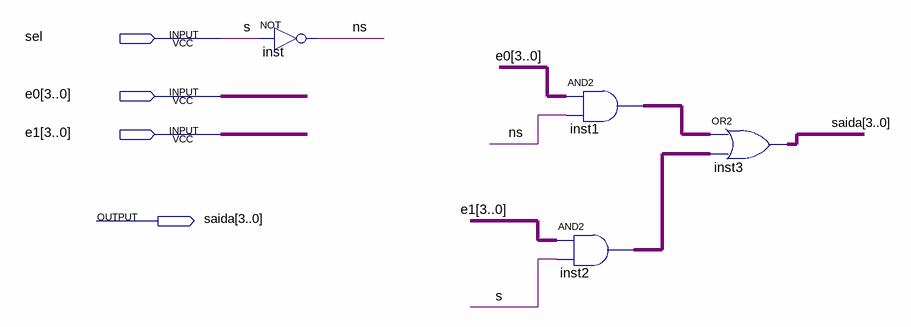
[diagram p0: schematic sheet]
// Quartus schematic mux2to1_4b.bdf as structural Verilog: 4 symbols, 4 pins
module mux2to1_4b (
  input  sel,
  input  [3:0] e0,
  input  [3:0] e1,
  output [3:0] saida
);

  wire ns;
  wire [3:0] inst1_out, inst2_out;

  not inst (ns, sel);
  assign inst1_out = e0 & {4{ns}};  // AND2 inst1, 4 bits wide
  assign inst2_out = e1 & {4{sel}};  // AND2 inst2, 4 bits wide
  assign saida = inst1_out | inst2_out;  // OR2 inst3, 4 bits wide

  // Other names for the same wires on the sheet: s = sel
endmodule
